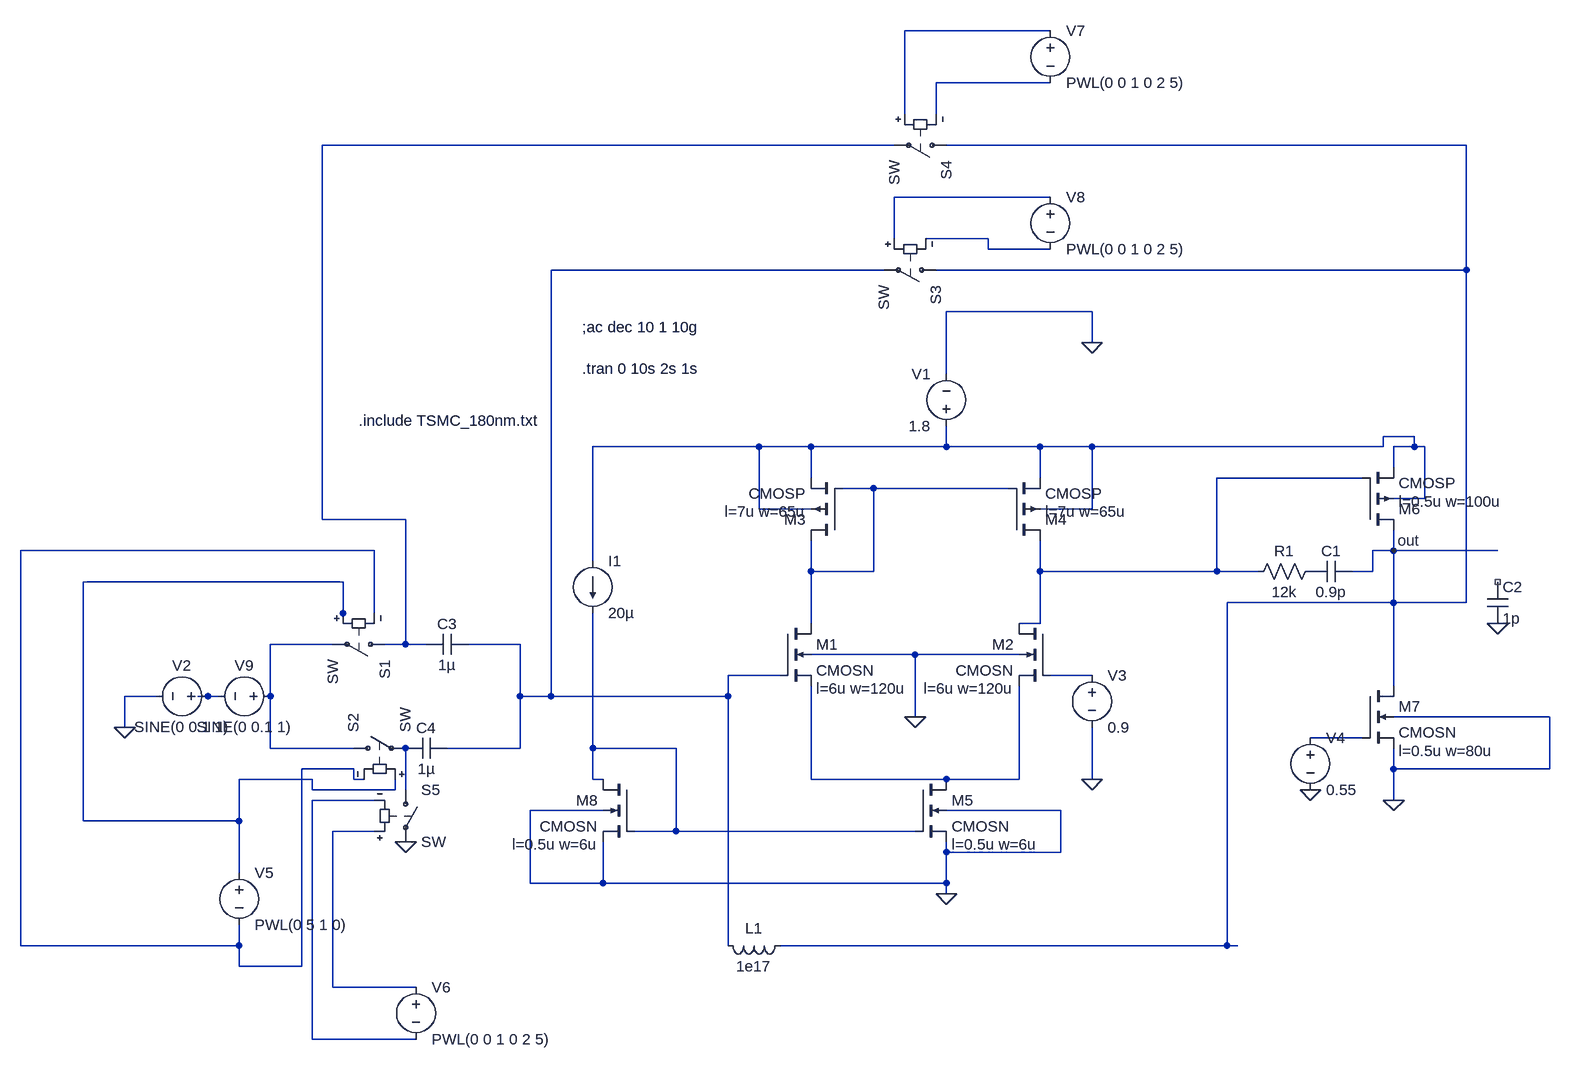
[diagram p0: schematic layout.asc]
layout.asc, the LTspice schematic file:
Version 4
SHEET 1 2056 1024
WIRE 16 -560 -208 -560
WIRE 16 -480 -160 -480
WIRE -208 -432 -208 -560
WIRE -160 -432 -160 -480
WIRE -224 -384 -1104 -384
WIRE 656 -384 -144 -384
WIRE 16 -304 -224 -304
WIRE -224 -240 -224 -304
WIRE -80 -240 -176 -240
WIRE -80 -224 -80 -240
WIRE 16 -224 -80 -224
WIRE -240 -192 -752 -192
WIRE 656 -192 656 -384
WIRE 656 -192 -160 -192
WIRE 80 -128 -144 -128
WIRE 80 -80 80 -128
WIRE -144 -32 -144 -128
WIRE 576 64 528 64
WIRE -432 80 -688 80
WIRE -352 80 -432 80
WIRE -144 80 -144 48
WIRE -144 80 -352 80
WIRE 0 80 -144 80
WIRE 80 80 0 80
WIRE 528 80 528 64
WIRE 528 80 80 80
WIRE 576 80 576 64
WIRE 576 80 544 80
WIRE 592 80 576 80
WIRE 544 112 544 80
WIRE -352 128 -352 80
WIRE 0 128 0 80
WIRE 496 128 272 128
WIRE -256 144 -304 144
WIRE -48 144 -256 144
WIRE 592 160 592 80
WIRE 592 160 544 160
WIRE -432 176 -432 80
WIRE -352 176 -432 176
WIRE 80 176 80 80
WIRE 80 176 0 176
WIRE -1104 192 -1104 -384
WIRE -976 192 -1104 192
WIRE -1024 240 -1568 240
WIRE 544 240 544 208
WIRE 544 240 512 240
WIRE 704 240 544 240
WIRE -688 256 -688 80
WIRE -352 272 -352 224
WIRE -256 272 -256 144
WIRE -256 272 -352 272
WIRE 0 272 0 224
WIRE 272 272 272 128
WIRE 272 272 0 272
WIRE 336 272 272 272
WIRE 512 272 512 240
WIRE 512 272 480 272
WIRE -1072 288 -1472 288
WIRE 544 320 544 240
WIRE 544 320 288 320
WIRE 656 320 656 -192
WIRE 656 320 544 320
WIRE -1072 336 -1072 288
WIRE -1024 336 -1024 240
WIRE -1072 352 -1072 336
WIRE -352 352 -352 272
WIRE 0 352 0 272
WIRE 0 352 -32 352
WIRE -1088 384 -1184 384
WIRE -976 384 -976 192
WIRE -976 384 -1008 384
WIRE -944 384 -976 384
WIRE -800 384 -880 384
WIRE -192 400 -352 400
WIRE -32 400 -192 400
WIRE -400 432 -480 432
WIRE 80 432 16 432
WIRE 544 448 544 320
WIRE -1360 464 -1408 464
WIRE -1280 464 -1296 464
WIRE -1264 464 -1280 464
WIRE -1184 464 -1184 384
WIRE -800 464 -800 384
WIRE -752 464 -752 -192
WIRE -752 464 -800 464
WIRE -480 464 -480 432
WIRE -480 464 -752 464
WIRE -192 496 -192 400
WIRE 784 496 544 496
WIRE -1408 512 -1408 464
WIRE 496 528 416 528
WIRE -1184 544 -1184 464
WIRE -1056 544 -1184 544
WIRE -800 544 -800 464
WIRE -800 544 -912 544
WIRE -688 544 -688 336
WIRE -560 544 -688 544
WIRE -1056 576 -1136 576
WIRE 544 576 544 544
WIRE 784 576 784 496
WIRE 784 576 544 576
WIRE -1120 592 -1232 592
WIRE -1056 592 -1056 576
WIRE -1040 592 -1056 592
WIRE -688 592 -688 544
WIRE -672 592 -688 592
WIRE -352 592 -352 448
WIRE -144 592 -352 592
WIRE -32 592 -32 448
WIRE -32 592 -144 592
WIRE 80 592 80 512
WIRE -1120 608 -1120 592
WIRE -992 608 -992 592
WIRE -992 608 -1120 608
WIRE -976 608 -976 544
WIRE -1024 624 -1120 624
WIRE 544 624 544 576
WIRE -672 640 -784 640
WIRE 32 640 -144 640
WIRE -1472 656 -1472 288
WIRE -1232 656 -1232 592
WIRE -1232 656 -1472 656
WIRE -1024 672 -1088 672
WIRE -560 672 -560 544
WIRE -560 672 -624 672
WIRE -192 672 -560 672
WIRE -144 704 -144 688
WIRE 32 704 32 640
WIRE 32 704 -144 704
WIRE -1232 736 -1232 656
WIRE -784 752 -784 640
WIRE -672 752 -672 688
WIRE -672 752 -784 752
WIRE -144 752 -144 704
WIRE -144 752 -672 752
WIRE -144 768 -144 752
WIRE -1568 848 -1568 240
WIRE -1232 848 -1232 816
WIRE -1232 848 -1568 848
WIRE -480 848 -480 464
WIRE 288 848 288 320
WIRE 288 848 -400 848
WIRE 304 848 288 848
WIRE -1232 880 -1232 848
WIRE -1136 880 -1136 576
WIRE -1136 880 -1232 880
WIRE -1088 912 -1088 672
WIRE -960 912 -1088 912
WIRE -1120 992 -1120 624
WIRE -960 992 -1120 992
FLAG 80 -80 0
FLAG -144 768 0
FLAG 544 624 0
FLAG 416 608 0
FLAG 704 352 0
FLAG -192 496 0
FLAG 544 240 out
FLAG 80 592 0
FLAG -1408 512 0
FLAG -976 688 0
DATAFLAG -32 576 ""
DATAFLAG 544 432 ""
DATAFLAG 448 336 ""
DATAFLAG -240 672 ""
DATAFLAG -256 400 ""
DATAFLAG -352 336 ""
DATAFLAG 0 272 ""
DATAFLAG 608 240 ""
SYMBOL nmos4 -400 352 R0
WINDOW 123 56 100 Left 2
SYMATTR Value2 l=6u w=120u
SYMATTR InstName M1
SYMATTR Value CMOSN
SYMBOL nmos4 16 352 M0
WINDOW 123 56 100 Left 2
SYMATTR Value2 l=6u w=120u
SYMATTR InstName M2
SYMATTR Value CMOSN
SYMBOL nmos4 -192 592 R0
WINDOW 123 56 100 Left 2
SYMATTR Value2 l=0.5u w=6u
SYMATTR InstName M5
SYMATTR Value CMOSN
SYMBOL pmos4 496 208 M180
WINDOW 123 56 44 Left 2
SYMATTR Value2 l=0.5u w=100u
SYMATTR InstName M6
SYMATTR Value CMOSP
SYMBOL nmos4 496 448 R0
WINDOW 123 56 100 Left 2
SYMATTR Value2 l=0.5u w=80u
SYMATTR InstName M7
SYMATTR Value CMOSN
SYMBOL voltage -144 64 R180
WINDOW 0 24 96 Left 2
WINDOW 3 24 16 Left 2
WINDOW 123 0 0 Left 0
WINDOW 39 0 0 Left 0
SYMATTR InstName V1
SYMATTR Value 1.8
SYMBOL current -688 256 R0
WINDOW 123 0 0 Left 0
WINDOW 39 0 0 Left 0
SYMATTR InstName I1
SYMATTR Value 20µ
SYMBOL nmos4 -624 592 M0
WINDOW 123 56 100 Left 2
SYMATTR Value2 l=0.5u w=6u
SYMATTR InstName M8
SYMATTR Value CMOSN
SYMBOL voltage 80 416 R0
WINDOW 123 0 0 Left 0
WINDOW 39 0 0 Left 0
SYMATTR InstName V3
SYMATTR Value 0.9
SYMBOL voltage 416 512 R0
WINDOW 123 0 0 Left 0
WINDOW 39 0 0 Left 0
SYMATTR InstName V4
SYMATTR Value 0.55
SYMBOL cap 688 288 R0
SYMATTR InstName C2
SYMATTR Value 1p
SYMBOL pmos4 -304 224 R180
WINDOW 123 56 44 Left 2
SYMATTR Value2 l=7u w=65u
SYMATTR InstName M3
SYMATTR Value CMOSP
SYMBOL pmos4 -48 224 M180
WINDOW 123 56 44 Left 2
SYMATTR Value2 l=7u w=65u
SYMATTR InstName M4
SYMATTR Value CMOSP
SYMBOL ind -384 832 R90
WINDOW 0 5 56 VBottom 2
WINDOW 3 32 56 VTop 2
SYMATTR InstName L1
SYMATTR Value 1e17
SYMBOL cap 480 256 R90
WINDOW 0 0 32 VBottom 2
WINDOW 3 32 32 VTop 2
SYMATTR InstName C1
SYMATTR Value 0.9p
SYMBOL res 432 256 R90
WINDOW 0 0 56 VBottom 2
WINDOW 3 32 56 VTop 2
SYMATTR InstName R1
SYMATTR Value 12k
SYMBOL cap -880 368 R90
WINDOW 0 0 32 VBottom 2
WINDOW 3 32 32 VTop 2
SYMATTR InstName C3
SYMATTR Value 1µ
SYMBOL cap -912 528 R90
WINDOW 0 0 32 VBottom 2
WINDOW 3 32 32 VTop 2
SYMATTR InstName C4
SYMATTR Value 1µ
SYMBOL sw -992 384 R90
SYMATTR InstName S1
SYMBOL sw -1072 544 R270
SYMATTR InstName S2
SYMBOL sw -144 -192 R90
SYMATTR InstName S3
SYMBOL sw -128 -384 R90
SYMATTR InstName S4
SYMBOL sw -976 592 R0
SYMATTR InstName S5
SYMBOL voltage -1264 464 R90
WINDOW 0 -32 56 VBottom 2
WINDOW 3 32 56 VTop 2
WINDOW 123 0 0 Left 0
WINDOW 39 0 0 Left 0
SYMATTR InstName V2
SYMATTR Value SINE(0 0.1 1)
SYMBOL voltage -1232 720 R0
WINDOW 123 0 0 Left 0
WINDOW 39 0 0 Left 0
SYMATTR InstName V5
SYMATTR Value PWL(0 5 1 0)
SYMBOL voltage -960 896 R0
WINDOW 123 0 0 Left 0
WINDOW 39 0 0 Left 0
SYMATTR InstName V6
SYMATTR Value PWL(0 0 1 0 2 5)
SYMBOL voltage 16 -576 R0
WINDOW 123 0 0 Left 0
WINDOW 39 0 0 Left 0
SYMATTR InstName V7
SYMATTR Value PWL(0 0 1 0 2 5)
SYMBOL voltage 16 -320 R0
WINDOW 123 0 0 Left 0
WINDOW 39 0 0 Left 0
SYMATTR InstName V8
SYMATTR Value PWL(0 0 1 0 2 5)
SYMBOL voltage -1168 464 R90
WINDOW 0 -32 56 VBottom 2
WINDOW 3 32 56 VTop 2
WINDOW 123 0 0 Left 0
WINDOW 39 0 0 Left 0
SYMATTR InstName V9
SYMATTR Value SINE(0 0.1 1)
TEXT -1048 40 Left 2 !.include TSMC_180nm.txt
TEXT -704 -104 Left 2 !;ac dec 10 1 10g
TEXT -704 -40 Left 2 !.tran 0 10s 2s 1s

The netlist it stands for:
* layout.asc
M1 N009 N006 N017 0 CMOSN l=6u w=120u
M2 N008 N013 N017 0 CMOSN l=6u w=120u
M5 N017 N016 0 0 CMOSN l=0.5u w=6u
M6 out N008 N007 N007 CMOSP l=0.5u w=100u
M7 out N015 0 0 CMOSN l=0.5u w=80u
V1 N007 0 1.8
I1 N007 N016 20µ
M8 N016 N016 0 0 CMOSN l=0.5u w=6u
V3 N013 0 0.9
V4 N015 0 0.55
C2 NC_01 0 1p
M3 N009 N009 N007 N007 CMOSP l=7u w=65u
M4 N008 N009 N007 N007 CMOSP l=7u w=65u
L1 out N006 1e17
C1 out P001 0.9p
R1 P001 N008 12k
C3 N006 N003 1µ
C4 N006 N018 1µ
S1 N003 N012 N011 N010 SW
S2 N012 N018 N011 N010 SW
S3 out N006 N004 N005 SW
S4 out N003 N001 N002 SW
S5 N018 0 N020 N019 SW
V2 N014 0 SINE(0 0.1 1)
V5 N011 N010 PWL(0 5 1 0)
V6 N020 N019 PWL(0 0 1 0 2 5)
V7 N001 N002 PWL(0 0 1 0 2 5)
V8 N004 N005 PWL(0 0 1 0 2 5)
V9 N012 N014 SINE(0 0.1 1)
.model NMOS NMOS
.model PMOS PMOS
.lib standard.mos
.include TSMC_180nm.txt
;ac dec 10 1 10g
.tran 0 10s 2s 1s
.backanno
.end